# Altium project BW1098OAK.PrjPcb (part 5 of 5)
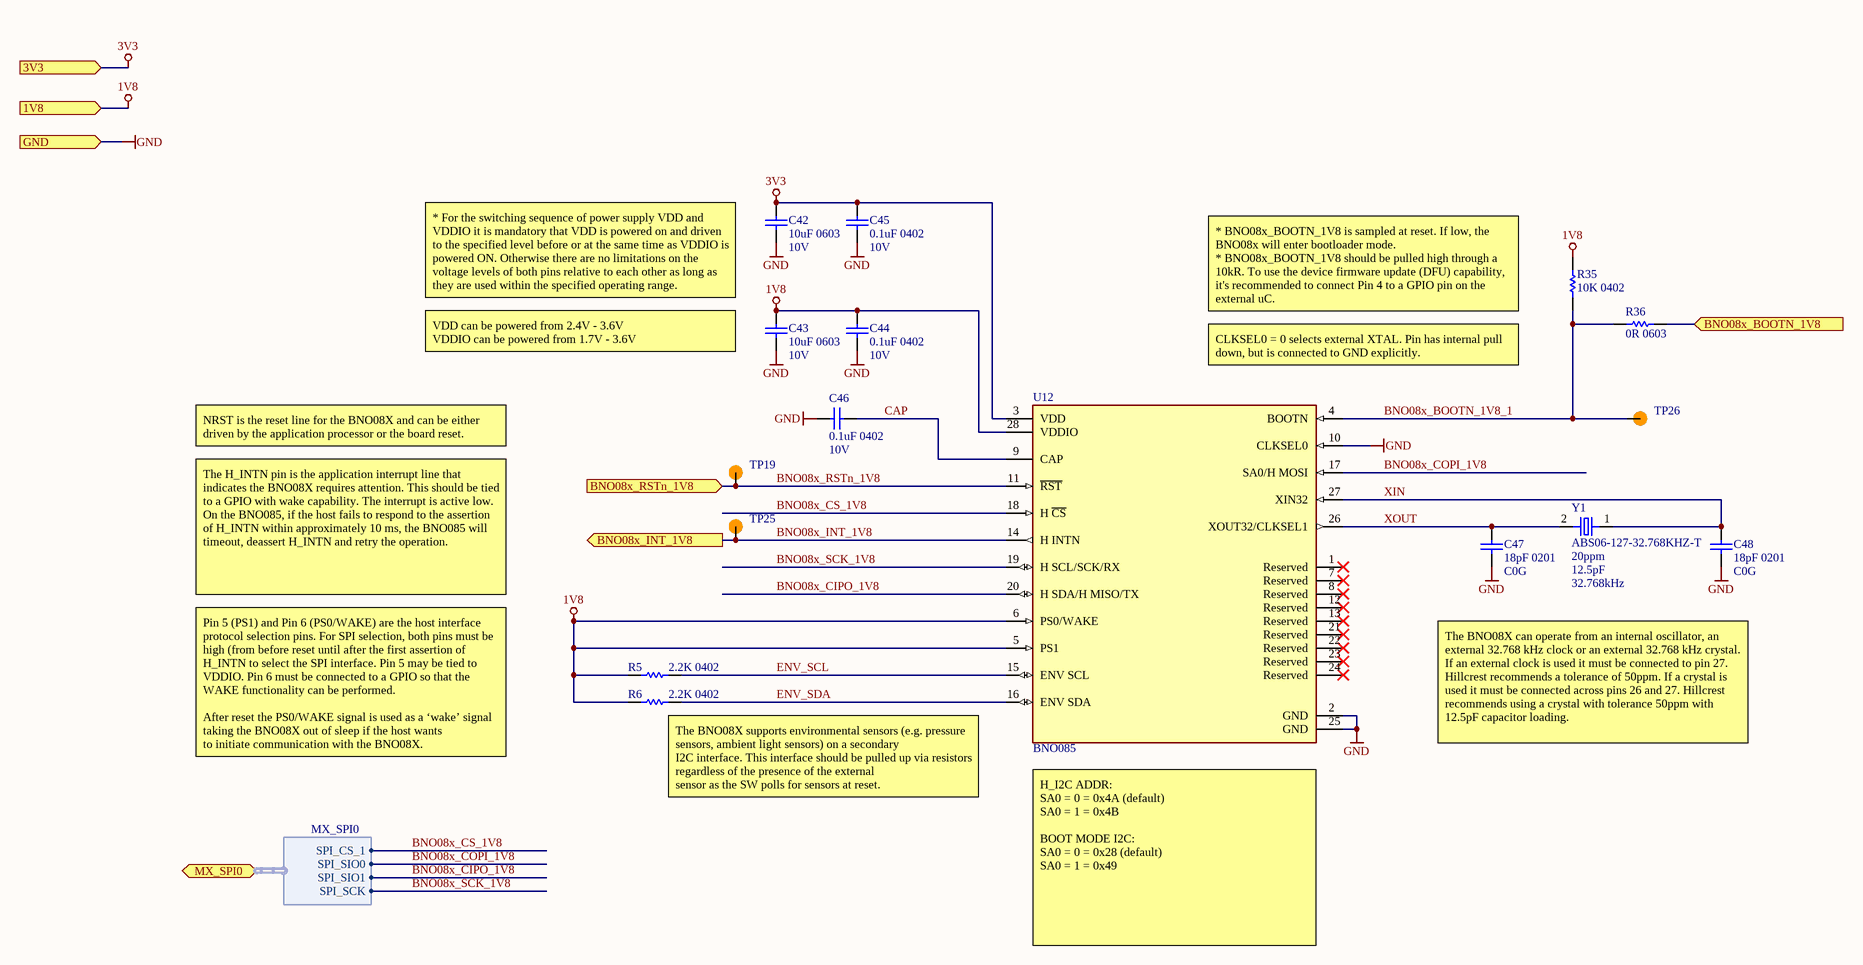
[diagram p9: BW1098OAK_IMU.SchDoc]

## Nets that join several sheets
1V2: BW1098OAK_Power_Supply (C39.2 TP10.1 U8.5), BW1098OAK_RIGHT_OV9282 (FB9.1), BW1098OAK_LEFT_OV9282 (FB6.1)
1V05: BW1098OAK_Power_Supply (5 pins), BW1098OAK_IMX378 (FB3.1)
1V8: BW1098OAK_Power_Supply (C18.2 TP11.1 U2.5), BW1098OAK_IMX378 (FB2.1), BW1098OAK_RIGHT_OV9282 (FB8.1), BW1098OAK_LEFT_OV9282 (FB5.1), BW1098OAK_IMU (8 pins)
2V8: BW1098OAK_Power_Supply (C20.2 TP12.1 U3.5), BW1098OAK_IMX378 (FB1.1), BW1098OAK_RIGHT_OV9282 (FB7.1), BW1098OAK_LEFT_OV9282 (FB4.1)
3V3: BW1098OAK_Power_Supply (C15.2 TP9.1 U1.1), BW1098OAK_USB (C35.2 R13.2 U5.6), BW1098OAK_IMU (C42.2 C45.2 U12.3)
GND: BW1098OAK_TopLevel (MP7.1 MP8.1), BW1098OAK_Power_Supply (34 pins), BW1098OAK_Connector (46 pins), BW1098OAK_IMX378 (16 pins), BW1098OAK_RIGHT_OV9282 (16 pins), BW1098OAK_LEFT_OV9282 (16 pins), BW1098OAK_USB (26 pins), BW1098OAK_IMU (10 pins)
VBUS: BW1098OAK_Power_Supply (TP8.1 U9.1 U10.3), BW1098OAK_Connector (J1.53), BW1098OAK_USB (9 pins)
VDD_5V: BW1098OAK_Power_Supply (21 pins), BW1098OAK_Connector (12 pins), BW1098OAK_USB (C36.2 R20.2 R21.2 U6.12)
BNO08x_BOOTN_1V8: BW1098OAK_Connector (J1.4), BW1098OAK_IMU (R36.2)
BNO08x_CIPO_1V8: BW1098OAK_Connector (J1.64 J5.4), BW1098OAK_IMU (U12.20)
BNO08x_COPI_1V8: BW1098OAK_Connector (J1.62 J5.2), BW1098OAK_IMU (U12.17)
BNO08x_CS_1V8: BW1098OAK_Connector (J1.60 J5.7), BW1098OAK_IMU (U12.18)
BNO08x_INT_1V8: BW1098OAK_Connector (J1.69), BW1098OAK_IMU (TP25.1 U12.14)
BNO08x_RSTn_1V8: BW1098OAK_Connector (J1.6), BW1098OAK_IMU (TP19.1 U12.11)
BNO08x_SCK_1V8: BW1098OAK_Connector (J1.74 J5.1), BW1098OAK_IMU (U12.19)
CAM_A_CLK_OUT: BW1098OAK_Connector (J1.28), BW1098OAK_IMX378 (J2.30)
CAM_A_PWDN_N: BW1098OAK_Connector (J1.34), BW1098OAK_IMX378 (J2.23 R1.1)
CAM_B_CLK_OUT: BW1098OAK_Connector (J1.73), BW1098OAK_RIGHT_OV9282 (J9.24), BW1098OAK_LEFT_OV9282 (J3.24)
CAM_B_D_PWM: BW1098OAK_Connector (J1.65), BW1098OAK_RIGHT_OV9282 (J9.22 R9.1)
CAM_B_PWDN_N: BW1098OAK_Connector (J1.67), BW1098OAK_LEFT_OV9282 (J3.22 R2.1)
COM_AUX_IO2: BW1098OAK_Connector (J1.42 TP4.1), BW1098OAK_LEFT_OV9282 (R4.1)
FSIN2: BW1098OAK_RIGHT_OV9282 (R10.2), BW1098OAK_LEFT_OV9282 (R26.2)
I2C1_SCL: BW1098OAK_Connector (J1.35), BW1098OAK_IMX378 (J2.20)
I2C1_SDA: BW1098OAK_Connector (J1.33), BW1098OAK_IMX378 (J2.19)
I2C2_SCL: BW1098OAK_Connector (J1.77), BW1098OAK_RIGHT_OV9282 (J9.21), BW1098OAK_LEFT_OV9282 (J3.21)
I2C2_SDA: BW1098OAK_Connector (J1.79), BW1098OAK_RIGHT_OV9282 (J9.20), BW1098OAK_LEFT_OV9282 (J3.20)
MIPI_RX2_C_N: BW1098OAK_Connector (J1.95), BW1098OAK_LEFT_OV9282 (J3.11)
MIPI_RX2_C_P: BW1098OAK_Connector (J1.97), BW1098OAK_LEFT_OV9282 (J3.10)
MIPI_RX2_D0_N: BW1098OAK_Connector (J1.89), BW1098OAK_LEFT_OV9282 (J3.8)
MIPI_RX2_D0_P: BW1098OAK_Connector (J1.91), BW1098OAK_LEFT_OV9282 (J3.7)
MIPI_RX2_D1_N: BW1098OAK_Connector (J1.83), BW1098OAK_LEFT_OV9282 (J3.5)
MIPI_RX2_D1_P: BW1098OAK_Connector (J1.85), BW1098OAK_LEFT_OV9282 (J3.4)
MIPI_RX3_C_N: BW1098OAK_Connector (J1.96), BW1098OAK_RIGHT_OV9282 (J9.11)
MIPI_RX3_C_P: BW1098OAK_Connector (J1.98), BW1098OAK_RIGHT_OV9282 (J9.10)
MIPI_RX3_D0_N: BW1098OAK_Connector (J1.90), BW1098OAK_RIGHT_OV9282 (J9.8)
MIPI_RX3_D0_P: BW1098OAK_Connector (J1.92), BW1098OAK_RIGHT_OV9282 (J9.7)
MIPI_RX3_D1_N: BW1098OAK_Connector (J1.84), BW1098OAK_RIGHT_OV9282 (J9.5)
MIPI_RX3_D1_P: BW1098OAK_Connector (J1.86), BW1098OAK_RIGHT_OV9282 (J9.4)
MIPI_RX4_C_N: BW1098OAK_Connector (J1.3), BW1098OAK_IMX378 (J2.28)
MIPI_RX4_C_P: BW1098OAK_Connector (J1.5), BW1098OAK_IMX378 (J2.27)
MIPI_RX4_D0_N: BW1098OAK_Connector (J1.9), BW1098OAK_IMX378 (J2.5)
MIPI_RX4_D0_P: BW1098OAK_Connector (J1.11), BW1098OAK_IMX378 (J2.6)
MIPI_RX4_D1_N: BW1098OAK_Connector (J1.15), BW1098OAK_IMX378 (J2.26)
MIPI_RX4_D1_P: BW1098OAK_Connector (J1.17), BW1098OAK_IMX378 (J2.25)
MIPI_RX5_D0_N: BW1098OAK_Connector (J1.21), BW1098OAK_IMX378 (J2.8)
MIPI_RX5_D0_P: BW1098OAK_Connector (J1.23), BW1098OAK_IMX378 (J2.9)
MIPI_RX5_D1_N: BW1098OAK_Connector (J1.27), BW1098OAK_IMX378 (J2.2)
MIPI_RX5_D1_P: BW1098OAK_Connector (J1.29), BW1098OAK_IMX378 (J2.3)
USB_D_N: BW1098OAK_Connector (J1.18), BW1098OAK_USB (J10.A7 J10.B7)
USB_D_P: BW1098OAK_Connector (J1.16), BW1098OAK_USB (J10.A6 J10.B6)
USB_RX_N: BW1098OAK_Connector (J1.12), BW1098OAK_USB (U5.4)
USB_RX_P: BW1098OAK_Connector (J1.10), BW1098OAK_USB (U5.3)
USB_TX_N: BW1098OAK_Connector (J1.24), BW1098OAK_USB (U5.8)
USB_TX_P: BW1098OAK_Connector (J1.22), BW1098OAK_USB (U5.7)

## Assembly variants
Production: not fitted B1 D1 D5 J5 J6 J8 MISC1 R18 R19 R22 R23 R25 R27 R28
Prod_ESD: not fitted B1 J5 J6 J8 MISC1 R18 R19 R22 R23 R25 R27 R28